# Altium project 830-00011 Microhard Module Breakout Board.PrjPcb
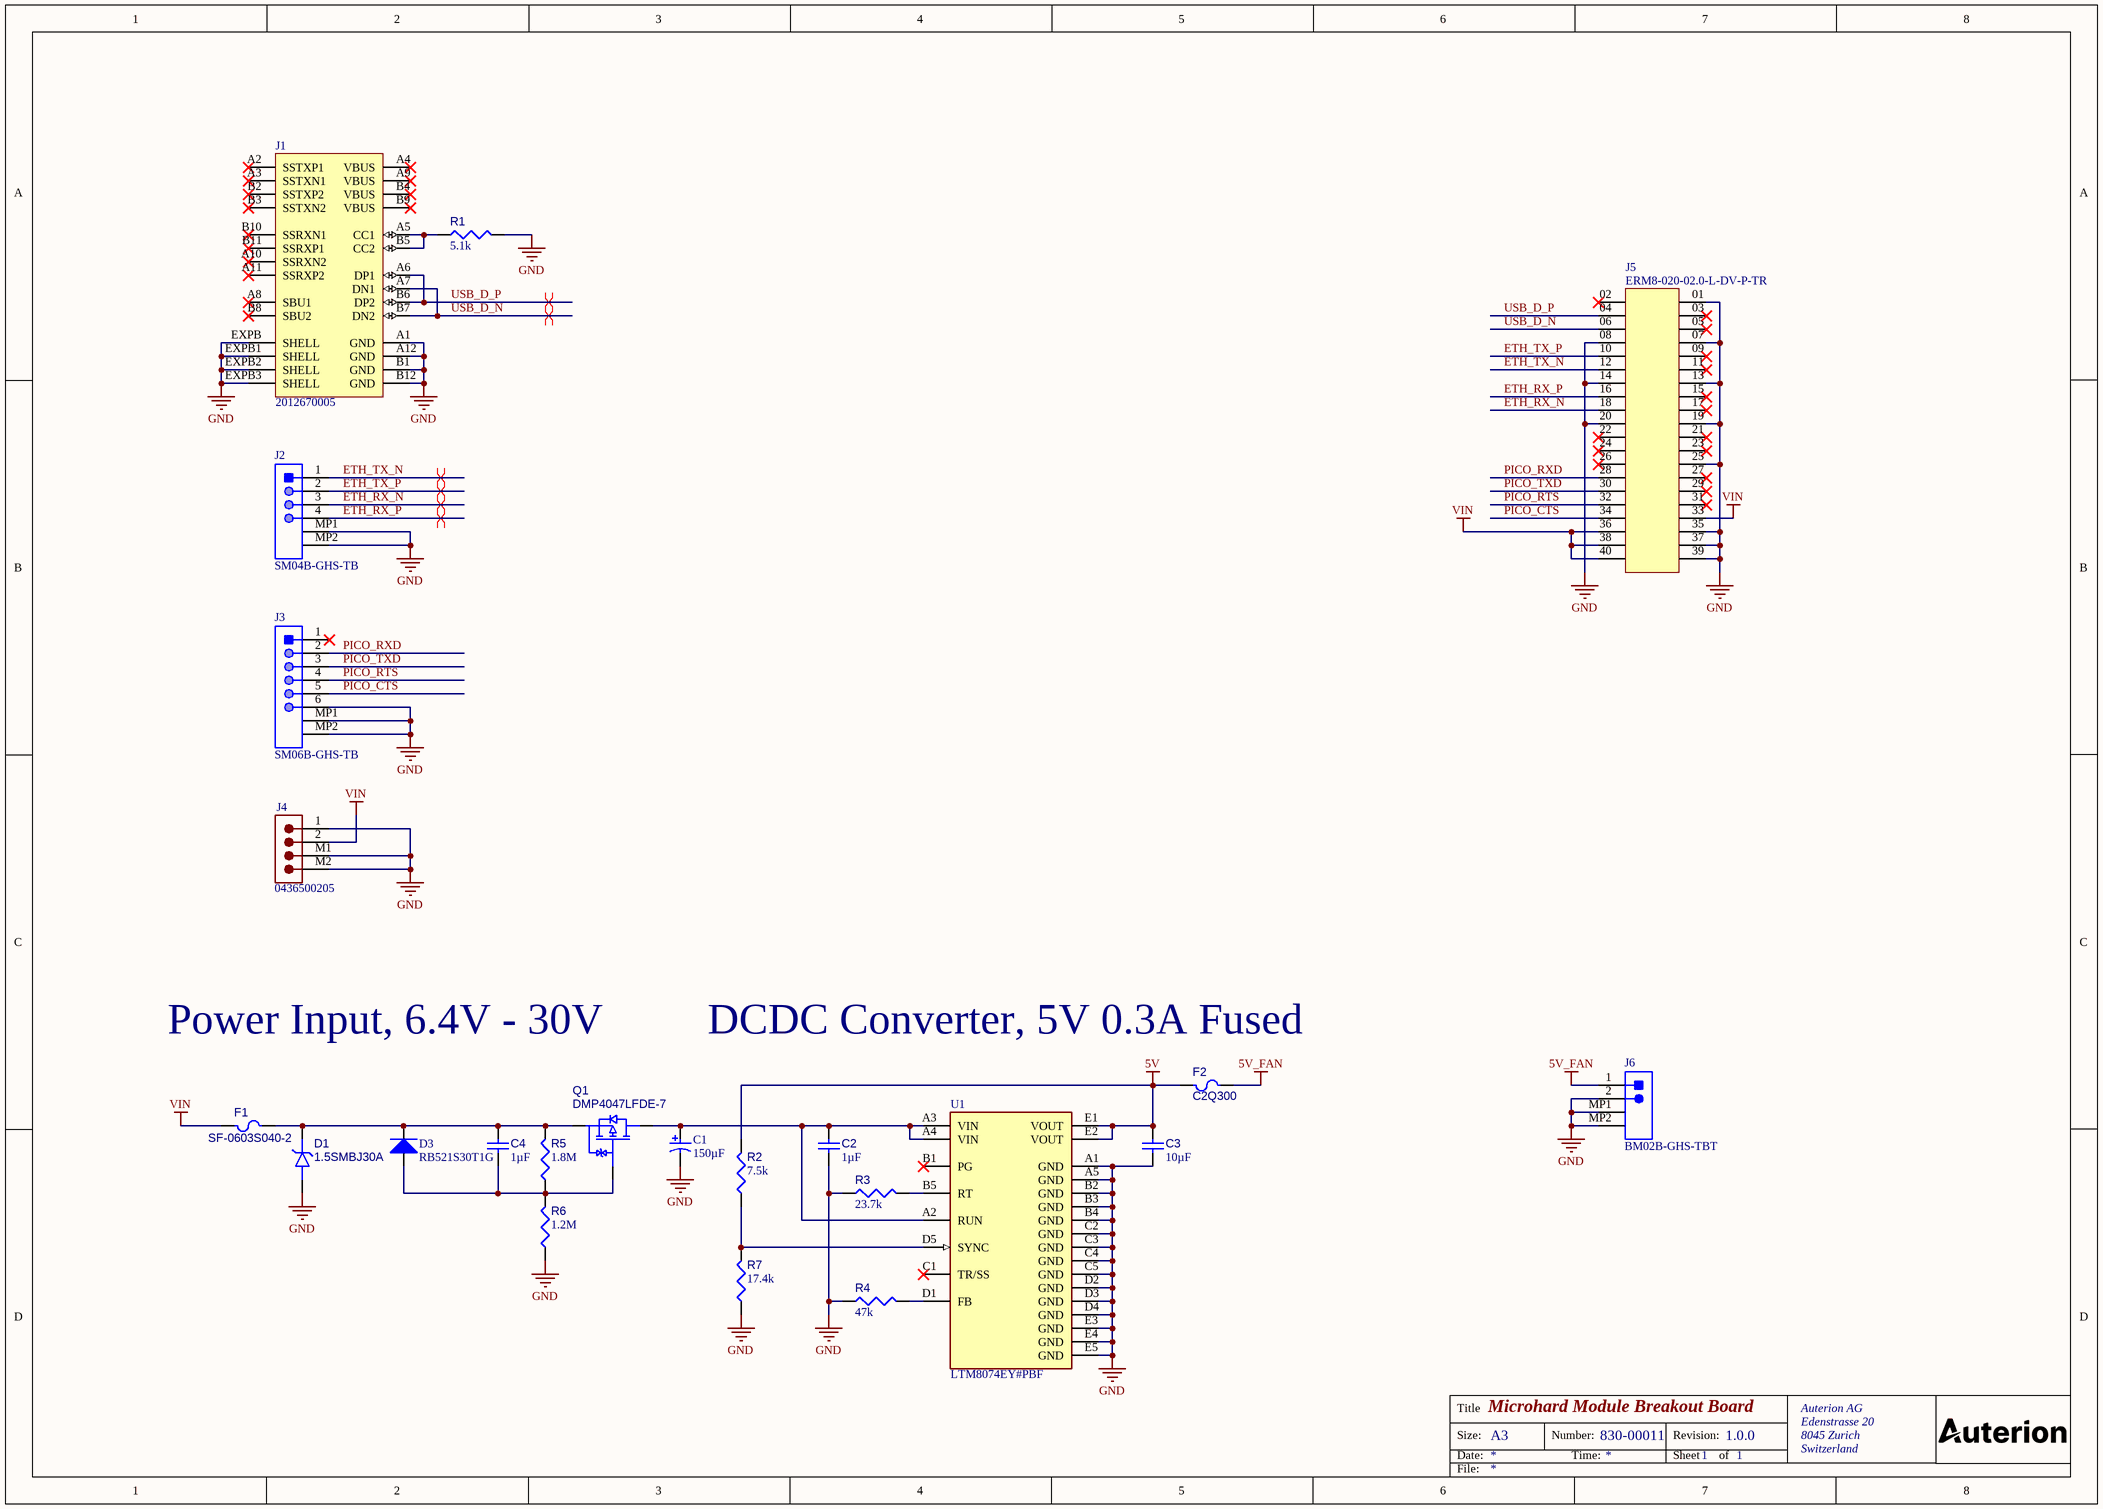
[diagram p0: 830-00011 Microhard Module Breakout Board.SchDoc]
ProjectStreet: Edenstrasse 20; ProjectRevCustom: 1.0.0; ProjectNumCustom: 830-00011; ProjectNameCustom: Microhard Module Breakout Board; ProjectCity: 8045 Zurich
1 sheet, 23 parts. Net scope: global (net labels, ports and power ports of the same name join across sheets).
Board file: 830-00011 Microhard Module Breakout Board.PcbDoc

## Sheet 830-00011 Microhard Module Breakout Board.SchDoc
size A3; Author: Christian Dobler; CompanyName: Auterion AG; DrawnBy: Christian Dobler; Engineer: Christian Dobler; Organization: Auterion AG; Address1: Edenstrasse 20; Address2: 8045 Zürich; Address3: Switzerland; SheetNumber: 1; SheetTotal: 1

### Parts
C1  value 150µF  [CAPAE6866X82L]  (hidden comment: UCM1V151MCL1GS)
C2  value 1µF  [CAPC0603(1608)100_L]  (hidden comment: 1uF / 0603 / 10% / 50V / X5R)
C3  value 10µF  [CAPC0805(2012)145_L]  (hidden comment: 10uF / 0805 / 20% / 16V / X7R)
C4  value 1µF  [CAPC0402(1005)60_L]  (hidden comment: 1uF / 0402 / 10% / 35V / X5R)
D1  1.5SMBJ30A  [JCET-SMB-2_N]
D3  RB521S30T1G  [ONSC-SOD-523-2-502-01_V]
F1  SF-0603S040-2  [RESC0603(1608)_L]
F2  C2Q300  [RESC0603(1608)_L]
J1  2012670005  [2012670005]
J2  SM04B-GHS-TB  [JST-SM04B-GHS-TB]
J3  SM06B-GHS-TB  [JST-SM06B-GHS-TB_V]
J4  0436500205  [SHDRRA2W64P300_2X1_965X990H437]
J5  ERM8-020-02.0-L-DV-P-TR  [FP-ERM8-020-02_0-L-DV-TR-MFG]
J6  BM02B-GHS-TBT  [JST-BM02B-GHS-TBT_V]
Q1  DMP4047LFDE-7  [DMP2066UFDE7]
R1  value 5.1k  [RESC0402(1005)_L]  (hidden comment: 5.1K / 0402 / 1% / 0.063W / 100PPM/K)
R2  value 7.5k  [RESC0402(1005)_L]  (hidden comment: 7.5K / 0402 / 1% / 0.063W / 100PPM/K)
R3  value 23.7k  [RESC0402(1005)_L]  (hidden comment: 23.7K / 0402 / 1% / 0.063W / 100PPM/K)
R4  value 47k  [RESC0402(1005)_L]  (hidden comment: 47K / 0402 / 1% / 0.063W / 100PPM/K)
R5  value 1.8M  [RESC0402(1005)_L]  (hidden comment: 1.8M / 0402 / 1% / 0.063W / 100PPM/K)
R6  value 1.2M  [RESC0402(1005)_L]  (hidden comment: 1.2M / 0402 / 1% / 0.063W / 100PPM/K)
R7  value 17.4k  [RESC0402(1005)_L]  (hidden comment: 17.4K / 0402 / 1% / 0.063W / 100PPM/K)
U1  LTM8074EY#PBF  [FP-BGA-25-05-08-1566-MFG]

### Nets
5V: C3.2 F2.1 R2.2 U1.E1(VOUT) U1.E2(VOUT)
5V_FAN: F2.2 J6.1
GND: C1.2 C2.1 C3.1 D1.A J1.A1(GND) J1.A12(GND) J1.B1(GND) J1.B12(GND) J1.EXPB(SHELL) J1.EXPB1(SHELL) J1.EXPB2(SHELL) J1.EXPB3(SHELL) J2.MP1 J2.MP2 J3.6 J3.MP1 J3.MP2 J4.1 J4.M1 J4.M2 J5.01 J5.07 J5.08 J5.13 J5.14 J5.19 J5.20 J5.25 J5.35 J5.37 J5.39 J6.2 J6.MP1 J6.MP2 R1.2 R3.1 R4.1 R6.1 R7.1 U1.A1(GND) U1.A5(GND) U1.B2(GND) U1.B3(GND) U1.B4(GND) U1.C2(GND) U1.C3(GND) U1.C4(GND) U1.C5(GND) U1.D2(GND) U1.D3(GND) U1.D4(GND) U1.E3(GND) U1.E4(GND) U1.E5(GND)
VIN: F1.1 J4.2 J5.33 J5.36 J5.38 J5.40
ETH_RX_N: J2.3 J5.18
ETH_RX_P: J2.4 J5.16
ETH_TX_N: J2.1 J5.12
ETH_TX_P: J2.2 J5.10
PICO_CTS: J3.5 J5.34
PICO_RTS: J3.4 J5.32
PICO_RXD: J3.2 J5.28
PICO_TXD: J3.3 J5.30
USB_D_N: J1.A7(DN1) J1.B7(DN2) J5.06
USB_D_P: J1.A6(DP1) J1.B6(DP2) J5.04
NetC1_1: C1.1 C2.2 Q1.D U1.A2(RUN) U1.A3(VIN) U1.A4(VIN)
NetC4_1: C4.1 D3.2(A) Q1.G R5.1 R6.2
NetC4_2: C4.2 D1.K D3.1(K) F1.2 Q1.S R5.2
NetJ1_A5: J1.A5(CC1) J1.B5(CC2) R1.1
NetR2_1: R2.1 R7.2 U1.D5(SYNC)
NetR3_2: R3.2 U1.B5(RT)
NetR4_2: R4.2 U1.D1(FB)

Not connected (* = marked no-connect by the designer): J1 A2(SSTXP1)* A3(SSTXN1)* A4(VBUS)* A8(SBU1)* A9(VBUS)* A10(SSRXN2)* A11(SSRXP2)* B2(SSTXP2)* B3(SSTXN2)* B4(VBUS)* B8(SBU2)* B9(VBUS)* B10(SSRXN1)* B11(SSRXP1)*; J3 1*; J5 02* 03* 05* 09* 11* 15* 17* 21* 22* 23* 24* 26* 27* 29* 31*; U1 B1(PG)* C1(TR/SS)*

### Layout directives
differential pair; differential pair class USB: USB_D_N, USB_D_P
differential pair; differential pair class ETH: ETH_RX_N, ETH_RX_P, ETH_TX_N, ETH_TX_P

### Notes on the sheet
- Power Input, 6.4V - 30V
- (near F2) DCDC Converter, 5V 0.3A Fused
- Title
- Size:
- Date:
- A3
- Number:
- Time:
- Revision:
- Sheet
- of
- File:

### Library data of the parts
C1 = CMP-001-00118-2: CAP ALUM 150UF 20% 35V SMD; Manufacturer: Nichicon; Capacitor Type: Aluminium; Ripple Current: 300mA; Leakage Current: 52.5uA; Ripple Current (AC): 600mA; Polarity: Polarized; Tan Delta: 0.12; Pins: 2; Termination: Flat; Max Operating Temperature: 105°C; Size Code: 2626; Mounting Technology: SMD; Positive Tolerance: 20%; REACH SVHC: Yes; Capacitance: 150uF; Number of Pins: 2; Min Operating Temperature: -55°C; Case/Package: 6.3x7.7mm; Rated DC Voltage (URdc): 35V; RoHS Compliant: Yes; Manufacturer Part Number: UCM1V151MCL1GS; Tolerance: 20%; Mount: Surface Mount; Voltage Rating: 35V; Terminal Finish: Tin; Negative Tolerance: 20%
C2 = CMP-001-00116-2: CAP CER 1UF 50V X5R 0603; Manufacturer Part Number: C1608X5R1H105K080AB; Manufacturer: TDK Corporation; Capacitor Type: Ceramic; Multilayer: Yes; Tolerance: 10%; Width: 0.8mm; Rated DC Voltage (URdc): 50V; Mounting Technology: SMD; Positive Tolerance: 10%; Capacitance: 1uF; RoHS Compliant: Yes; Pins: 2; Min Operating Temperature: -55°C; Temperature Characteristics Code: X5R; Negative Tolerance: 10%; Max Operating Temperature: 85°C; Terminal Finish: Nickel; Number of Pins: 2; Size Code: 0603; Mount: Surface Mount; Termination: Wraparound; Voltage Rating: 50V; Length: 1.6mm; Height: 0.8mm; Packaging: Tape and Reel; Case/Package: 0603; REACH SVHC: Yes
C3 = CMP-001-00087-3: CAP CER 10UF 16V X7R 0805; Manufacturer: Taiyo Yuden; Manufacturer Part Number: EMK212BB7106MG-T; Multilayer: Yes; Capacitor Type: Ceramic; Voltage Rating: 16V; Height: 1.25mm; Capacitance: 10uF; REACH SVHC: Yes; Tolerance: 20%; Size Code: 0805; Positive Tolerance: 20%; Mount: Surface Mount; Number of Pins: 2; Length: 2mm; Mounting Technology: SMD; Temperature Characteristics Code: X7R; Packaging: Tape and Reel; Negative Tolerance: 20%; Pins: 2; Case/Package: 0805; Min Operating Temperature: -55°C; RoHS Compliant: Yes; Max Operating Temperature: 125°C; Width: 1.25mm; Termination: Wraparound; Rated DC Voltage (URdc): 16V
C4 = CMP-001-00120-2: CAP CER 1UF 35V X5R 0402; Manufacturer: TDK Corporation; Manufacturer Part Number: C1005X5R1V105K050BC; Capacitor Type: Ceramic; Multilayer: Yes; Pins: 2; Tolerance: 10%; Min Operating Temperature: -55°C; Terminal Finish: Nickel; Size Code: 0402; Case/Package: 0402; Voltage Rating: 35V; RoHS Compliant: Yes; Max Operating Temperature: 85°C; Capacitance: 1uF; Rated DC Voltage (URdc): 35V; Height: 0.5mm; Positive Tolerance: 10%; Negative Tolerance: 10%; Temperature Characteristics Code: X5R; Number of Pins: 2; Mount: Surface Mount; Width: 0.5mm; REACH SVHC: Yes; Termination: Wraparound; Packaging: Tape and Reel; Mounting Technology: SMD; Length: 1mm
D1 = CMP-004-00044-1: TVS Diode Single Uni-Dir 30V 1.5KW 2-Pin SMB T/R; Manufacturer: Bourns; Peak Inverse Voltage: 48.4V; Max Surge Current: 100A; Forward Current: 0A; Pins: 2; RoHS Compliant: Yes; Manufacturer Part Number: 1.5SMBJ30A; Max Operating Temperature: 150°C; Min Operating Temperature: -55°C; Case/Package: SMB (DO-214AA); Forward Voltage: 30V; Mounting Technology: SMD
D3 = CMP-004-00041-1: Rectifier Diode, Schottky, 1 Phase, 1 Element, 0.2A, 30V V(RRM), Silicon; Manufacturer: onsemi; Max Surge Current: 1A; Forward Current: 200mA; Forward Voltage: 500mV; Case/Package: SOD-523; Peak Inverse Voltage: 30V; Mounting Technology: SMD; Min Operating Temperature: -55°C; RoHS Compliant: Yes; Pins: 2; Manufacturer Part Number: RB521S30T1G; Max Operating Temperature: 125°C
F1 = CMP-00008-1: Electric Fuse, Slow Blow, 0.4A, 35VAC, 50VDC, 50A (IR), Surface Mount, 0603; Manufacturer: Bourns Inc.; Body Length or Diameter: 1.6mm; Voltage Rating: 50V; Reverse current protection (OFF state): No; DC Resistance: 0.54; Min. Input Voltage: 0V; Current Rating: 400mA; Min. Output Current: 0A; Body Breadth: 0.82inch; Body Height: 0.48mm; Voltage Rating (AC): 35V; Joule-integral-Nom: 0.004J; Fuse Size: 0603; Min Operating Temperature: -55°C; Case/Package: 0603; Termination: Wraparound; Undervoltage Lockout: No; Overvoltage Protection: No; Function: Fuse; Manufacturer Part Number: SF-0603S040-2; Max. Input Voltage: 50V; RoHS Compliant: Yes; REACH SVHC: Yes; Voltage Rating (DC): 50V; Terminal Finish: Tin; Rated Breaking Capacity: 50A; Blow Characteristic: SLOW; Mount: Surface Mount; Circuit Protection Type: Electric Fuse; Max Operating Temperature: 125°C; Max. Output Current: 400mA; Mounting Technology: SMD; Pins: 2; Packaging: Tape and Reel; Reverse current protection (ON state): No
F2 = CMP-00030-00002-3: Electric Fuse, Very Fast Blow, 0.3A, 32VAC, 63VDC, 35A (IR), Surface Mount, 0603; Manufacturer: Bel Fuse Inc.; Voltage Rating (DC): 63V; Current Rating: 300mA; Body Breadth: 0.82inch; Fuse Size: 0603; Voltage Rating (AC): 32V; Body Height: 0.48mm; Body Length or Diameter: 1.6mm; Joule-integral-Nom: 0.0001J; DC Resistance: 0.54; Min. Input Voltage: 0V; Min. Output Current: 0A; Overvoltage Protection: No; Case/Package: 0603; Min Operating Temperature: -55°C; Max Operating Temperature: 125°C; RoHS Compliant: Yes; Terminal Finish: Tin; REACH SVHC: Yes; Circuit Protection Type: Electric Fuse; Mount: Surface Mount; Manufacturer Part Number: C2Q 300; Rated Breaking Capacity: 35A; Pins: 2; Packaging: Tape and Reel; Blow Characteristic: VERY FAST; Mounting Technology: SMD; Voltage Rating: 63V; Termination: Wraparound; Function: Fuse; Max. Input Voltage: 63V; Max. Output Current: 300mA; Reverse current protection (OFF state): No; Reverse current protection (ON state): No; Undervoltage Lockout: No
J1 = CMP-053-000003-5: USB Connector, 24 Contact(s), Female, Right Angle, Surface Mount Terminal, Locking, Receptacle; Manufacturer: Molex; Mfr Part Description: CONN RCP USB3.1 TYPEC 24P SMD RA; Max Current Rating: 5A; Rows: 2; Current_Rating: 0.25A, 1.25A, 5A; Voltage Rating: 30V; Updated By: aklimaj; Value: 2012670005; Mounting Technology: SMD/TH; ComponentLink1Description: Datasheet; Manufacturer Part Number: 2012670005; Created_Date: 2019/07/23 10:45:55; ComponentLink1URL: https://www.molex.com/pdm_docs/sd/2012670005_sd.pdf; Gender: Female; Design Item ID: 30530; Part_Type: Connector; RoHS: Yes; Max Operating Temperature: 105°C; RoHS Compliant: Yes; ComponentLink2URL: https://www.digikey.com/product-detail/en/molex/2012670005/WM17992CT-ND/8593492; Pins: 24; ComponentLink2Description: Supplier Part Details; Min Operating Temperature: -40°C; Temperature Range: -40C to +105C; Updated_Date: 2019/07/23 12:28:46; Mfr Part Number: 2012670005; Source: skynode_v2_base.SCHLIB; Orientation: Right Angle; Connector Type: USB; Created By: aklimaj
J2 = CMP-002-00087-2: 4 Positions Header Connector 1.25mm SMD Right Angle; SFL Part Number: 10751; Manufacturer: JST; Manufacturer Part Number: SM04B-GHS-TB(LF)(SN); Number of Positions Loaded: All; Shrouding: Shrouded - 4 Wall; Voltage Rating: 50V; Mated Stacking Heights: 4.35mm; Max Current Rating: 1A; Material Flammability Rating: UL94 V-0; Style: Board to Cable/Wire; Pitch - Mating: 0.049" (1.25mm); Number of Positions: 4; Rows: 1; Placetec Part Number: *; Insulation Color: Natural; Contact Finish - Mating: Tin; Contact Finish - Post: Tin; Parameter 1: *; Fastening Type: Locking Ramp; Number of Rows: 1; Contact Shape: Rectangular; Pins: 4; RoHS: RoHS Compliant; Features: Solder Retention; Contact Type: Outer Shroud Contact; Termination: Solder; Insulation Height: 0.167" (4.25mm); Insulation Material: Polyamide (PA9T), Nylon 9T; Mounting Technology: SMD; Source: Microhard Carrier.SCHLIB; Mounting Type: Surface Mount, Right Angle; Operating Temperature: -25°C ~ 85°C; Design Item ID: B2W - SM04B-GHS-TB; Orientation: Right Angle; ComponentLink1Description: http://www.jst-mfg.com/product/pdf/eng/eGH.pdf; Contact Material: Phosphor Bronze; Connector Type: Header; Current Rating: 1A; Category: Connectors, Interconnects; RoHS Compliant: Yes; Part Status: Active; ComponentLink1URL: http://www.jst-mfg.com/product/pdf/eng/eGH.pdf; Packaging: Cut Tape (CT)
J3 = CMP-002-00088-2: JST GH Series Connector, Pitch 1.25 mm, 1 x 6 Position, Right Angle, Height 4.35 mm, -25 to 85 degC, RoHS, Tape and Reel; SFL Part Number: 10703; Manufacturer Part Number: SM06B-GHS-TB(LF)(SN); Connector Type: Outer Shroud Contact; Number of Positions: 6; Rows: 1; Pitch: 1.25mm; Voltage Rating: 50V; Contact Resistance: 50mR; Current Rating: 1A; ComponentLink1URL: http://www1.futureelectronics.com/doc/JST/JST%20SM06B-GHS-TB__LF__SN.pdf; Color: Natural; Mount: Surface Mount; Orientation: Right Angle; RoHS Compliant: Yes; Number of Rows: 1; ComponentLink1Description: http://www1.futureelectronics.com/doc/JST/JST%20SM06B-GHS-TB__LF__SN.pdf; Lead Free: Lead Free; Packaging: Tape and Reel; Fastening Type: Ramp; Pins: 6; Mounting Technology: SMD; Manufacturer: JST; Contact Material: Bronze; Max Operating Temperature: 85°C; Length: 10.75mm; Depth: 4.05mm; Source: Microhard Carrier.SCHLIB; Design Item ID: B2W - SM06B-GHS-TB; Contact Plating: Copper,Tin; Housing Color: Beige; Max Current Rating: 1A; Number of Contacts: 6; Termination: Solder; Housing Material: Polyamide; Min Operating Temperature: -25°C
J4 = CMP-002-00072-2: CONN MALE HEADER R/A 2POS 3MM; Manufacturer: Molex; Rows: 1; Max Current Rating: 8.5A; Voltage Rating: 600V; Connector Type: Power,Rectangular; Contact Gender: Male; Orientation: Right Angle; Pins: 2; Mounting Technology: THT; Manufacturer Part Number: 0436500205; Min Operating Temperature: -40°C; Max Operating Temperature: 105°C; RoHS Compliant: Yes; Gender: Male
J5 = CMP-002-00076-1: Board Stacking Connector, 40 Contact(s), 2 Row(s), Male, Straight, 0.8mm Pitch, Surface Mount Terminal, Black Insulator; Manufacturer Series: ERM8; Manufacturer: Samtec; Max Current Rating: 2.2A; Number of Rows Loaded: 2; Body Breadth: 0.22inch; Mating Contact Pitch: 0.031inch; Number of Contacts: 40; Body Length: 0.866inch; Insulation Material: Polymer; RoHS Compliant: Yes; Mounting Technology: SMD; Connector Type: BOARD STACKING CONNECTOR; Contact Finish - Mating: GOLD (10) OVER NICKEL (50); Contact Material: Bronze; Manufacturer Part Number: ERM8-020-02.0-L-DV-P-TR; Contact Finish - Termination: Matte Tin (Sn) - with Nickel (Ni) barrier; Termination: SMD/SMT; Max Operating Temperature: 125°C; Min Operating Temperature: -55°C; Mounting Style: STRAIGHT; Mount: Board; Contact Gender: Male; Rows: 2; Rated Current (Signal): 2.2A; Pins: 40; Insulation Color: Black; Orientation: Straight; Gender: Male
J6 = CMP-002-00061-4: Disconnectable Crimp Style Connector, Pitch 1.25 mm, 1 x 2 Position, Height 4.05 mm, -25 to 85 degC, RoHS, Tape and Reel; Manufacturer: JST Sales America Inc.; Voltage Rating: 50V; Gender: Female; Rows: 1; Connector Type: Header,Shrouded; Max Current Rating: 1A; RoHS Compliant: Yes; Min Operating Temperature: -25°C; Pins: 2; Orientation: Straight; Manufacturer Part Number: BM02B-GHS-TBT; Mounting Technology: SurfaceMount; Case/Package: Disconnectable Crimp Style Connector, Pitch 1.25 mm, 1 x 2 Position, Height 4.05 mm; Max Operating Temperature: 85°C
Q1 = CMP-013-00039-1: MOSFET P-CH 40V 3.3A 6UDFN; Manufacturer: Diodes Incorporated; Polarity/Channel Type: P-CHANNEL; Vgs(th) (Max) @ Id: 2.2V @ 250uA; Transistor Type: PMOS; Vgs (Max): 2.2V; Drain Current-Max (Abs) (ID): 6A; Power: 700mW; FET Technology: METAL-OXIDE SEMICONDUCTOR; Drain-source On Resistance-Max: 33mR; Transistor Element Material: SILICON; Time @ Peak Reflow Temperature-Max (s): 40s; Operating Mode: ENHANCEMENT MODE; Case Connection: DRAIN; Package Body Material: Plastic; Rds On (Max): 50m; Power Dissipation-Max (Abs): 2.1W; REACH SVHC: Yes; Mounting Technology: SMD; Drain Current-Max (ID): 3.3A; Drain to Source Voltage Vds (Max): 40V; Moisture Sensitivity Level: 1; Max Operating Temperature: 150°C; Surface Mount: Yes; RoHS Compliant: Yes; Terminal Form: No Lead; Pins: 8; Continuous Drain Current Id (Max): 3.3A; Nominal Vgs: 2.2V; Terminal Finish: Nickel; Number of Pins: 3; Peak Reflow Temperature (Cel): 260°C; Manufacturer Part Number: DMP4047LFDE-7; Terminal Position: DUAL; Min Operating Temperature: -55°C; Case/Package: U-DFN2020-6; DS Breakdown Voltage-Min: 40V
R1 = CMP-009-00232-2: Fixed Resistor, Metal Glaze/thick Film, 0.0625W, 5100ohm, 50V, 5% +/-Tol, 100ppm/Cel, Surface Mount, 0402; Manufacturer Part Number: RC0402JR-075K1L; Manufacturer: YAGEO; Package Width: 0.5mm; Resistance: 5.1kR; Rated Temperature: 70°C; Temperature Coefficient: 100ppm/°C; Rated Power Dissipation (P): 62.5mW; Power: 63mW; Package Length: 1mm; Package Height: 0.35mm; Mounting Technology: SMD; Technology: METAL GLAZE/THICK FILM; RoHS Compliant: Yes; REACH SVHC: Yes; Size Code: 0402; Packaging: Tape and Reel; Min Operating Temperature: -55°C; Voltage Rating: 50V; Case/Package: 0402; Tolerance: 5%; Pins: 2; Termination: Wraparound; Working Voltage: 50V; Mount: Surface Mount; Number of Pins: 2; Terminal Finish: Nickel; Max Operating Temperature: 155°C; Construction: Chip
R2 = CMP-009-00235-2: RES 7.5K OHM 1% 1/16W 0402; Manufacturer: YAGEO; Manufacturer Part Number: RC0402FR-077K5L; Temperature Coefficient: 100ppm/°C; Power: 63mW; Package Length: 1mm; Working Voltage: 50V; Package Width: 0.5mm; Resistance: 7.5kR; Rated Power Dissipation (P): 62.5mW; Package Height: 0.35mm; Rated Temperature: 70°C; Mount: Surface Mount; Mounting Technology: SMD; Size Code: 0402; Tolerance: 1%; REACH SVHC: Yes; Min Operating Temperature: -55°C; Voltage Rating: 50V; Number of Pins: 2; Termination: Wraparound; Technology: METAL GLAZE/THICK FILM; Pins: 2; Max Operating Temperature: 155°C; Packaging: Tape and Reel; Terminal Finish: Nickel; RoHS Compliant: Yes; Case/Package: 0402
R3 = CMP-009-00231-2: RES 23.7K OHM 1% 1/16W 0402; Manufacturer Part Number: RC0402FR-0723K7L; Manufacturer: YAGEO; Power: 63mW; Package Length: 1mm; Rated Power Dissipation (P): 62.5mW; Rated Temperature: 70°C; Resistance: 23.7kR; Package Height: 0.35mm; Package Width: 0.5mm; Temperature Coefficient: 100ppm/°C; Voltage Rating: 50V; Terminal Finish: Nickel; Min Operating Temperature: -55°C; Case/Package: 0402; Tolerance: 1%; Pins: 2; Technology: METAL GLAZE/THICK FILM; Construction: Chip; RoHS Compliant: Yes; Max Operating Temperature: 155°C; Number of Pins: 2; Packaging: Tape and Reel; Mount: Surface Mount; Termination: Wraparound; Size Code: 0402; REACH SVHC: Yes; Working Voltage: 50V; Mounting Technology: SMD
R4 = CMP-009-00221-2: Fixed Resistor, Metal Glaze/thick Film, 0.0625W, 47000ohm, 50V, 1% +/-Tol, 100ppm/Cel, Surface Mount, 0402; Manufacturer: Yageo; Manufacturer Part Number: RC0402FR-0747KL; Power: 63mW; Temperature Coefficient: 100ppm/°C; RoHS Compliant: Yes; Mounting Technology: SMD; Tolerance: 1%; Pins: 2; Voltage Rating: 50V; Min Operating Temperature: -55°C; Max Operating Temperature: 155°C; Case/Package: 0402
R5 = CMP-009-00234-3: RES SMD 1.8M OHM 1% 1/16W 0402; Manufacturer: Samsung Electro-Mechanics; Manufacturer Part Number: RC1005F185CS; Resistance: 1.8MR; Temperature Coefficient: 100ppm/°C; Rated Power Dissipation (P): 62.5mW; Voltage Rating: 50V; Power: 63mW; Package Height: 0.35mm; Rated Temperature: 70°C; Package Length: 1mm; Package Width: 0.5mm; Case/Package: 0402; Mounting Technology: SMD; Max Operating Temperature: 155°C; Pins: 2; Working Voltage: 50V; Size Code: 0402; Packaging: Tape and Reel; Number of Pins: 2; Technology: METAL GLAZE/THICK FILM; Terminal Finish: Nickel; Mount: Surface Mount; REACH SVHC: Yes; Termination: Wraparound; Tolerance: 1%; Min Operating Temperature: -55°C; RoHS Compliant: Yes
R6 = CMP-009-00217-2: Fixed Resistor, Metal Glaze/thick Film, 0.0625W, 1200000ohm, 50V, 1% +/-Tol, 100ppm/Cel, Surface Mount, 0402; Manufacturer: Yageo; Manufacturer Part Number: RC0402FR-071M2L; Temperature Coefficient: 100ppm/°C; Power: 63mW; Voltage Rating: 50V; Min Operating Temperature: -55°C; RoHS Compliant: Yes; Max Operating Temperature: 155°C; Tolerance: 1%; Mounting Technology: SMD; Pins: 2; Case/Package: 0402
R7 = CMP-009-00187-2: RES SMD 17.4K OHM 1% 1/16W 0402; Manufacturer: Vishay Dale; Manufacturer Part Number: CRCW040217K4FKED; Reference Standard: AEC-Q200; Voltage Rating: 50V; Package Width: 0.5mm; Package Length: 1mm; Rated Temperature: 70°C; Temperature Coefficient: 100ppm/°C; Power: 63mW; Package Height: 0.35mm; Resistance: 17.4kR; Size Code: 0402; Termination: Wraparound; Mount: Surface Mount; Mounting Technology: SMD; Packaging: Tape and Reel; Working Voltage: 50V; Min Operating Temperature: -55°C; Pins: 2; Number of Pins: 2; Terminal Finish: Nickel; Tolerance: 1%; REACH SVHC: Yes; Construction: Chip; RoHS Compliant: Yes; Rated Power Dissipation (P): 63mW; Max Operating Temperature: 155°C; Case/Package: 0402; Technology: METAL GLAZE/THICK FILM
U1 = CMP-019-00055-2: Switching Regulator, Current-mode, 2200kHz Switching Freq-Max, PBGA25; Manufacturer: Analog Devices; Max Input Voltage: 42V; Programmable Output Voltage: Yes; Min Output Voltage: 800mV; Min Input Voltage: 3.2V; Topology: Synchronous Buck; Max Output Voltage: 12V; Dropout Voltage: 2V; Output Current: 1.2A; Min Operating Temperature: -40°C; RoHS Compliant: Yes; Mounting Technology: SMD; Case/Package: 25-BGA (4x4); Max Operating Temperature: 125°C; Pins: 25; Manufacturer Part Number: LTM8074EY#PBF